# Altium schematic sheet Top Level.SchDoc
size A4
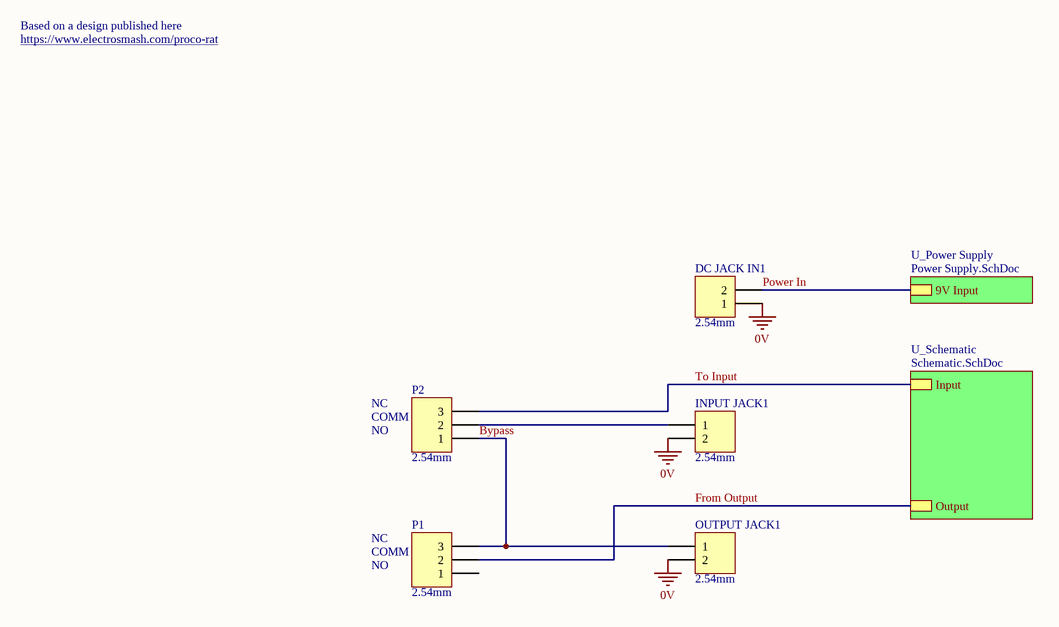
[diagram p0: Top Level.SchDoc]

## Parts
DC_JACK_IN1  2.54mm  [TH 2.54mm Header 1x2]
INPUT_JACK1  2.54mm  [TH 2.54mm Header 1x2]
OUTPUT_JACK1  2.54mm  [TH 2.54mm Header 1x2]
P1  2.54mm  [TH 2.54mm Header 1x3]
P2  2.54mm  [TH 2.54mm Header 1x3]

## Sub-sheets
U_Power Supply = Power Supply.SchDoc: 9V Input
U_Schematic = Schematic.SchDoc: Output, Input

## Nets
0V: DC_JACK_IN1.1 INPUT_JACK1.2 OUTPUT_JACK1.2
Bypass: OUTPUT_JACK1.1 P1.3 P2.1
From Output: P1.2 ; sheet U_Schematic/Output
Power In: DC_JACK_IN1.2 ; sheet U_Power Supply/9V Input
To Input: P2.3 ; sheet U_Schematic/Input
NetINPUT_JACK1_1: INPUT_JACK1.1 P2.2

Not connected (* = marked no-connect by the designer): P1 1

## Notes on the sheet
- https://www.electrosmash.com/proco-rat
- Based on a design published here
- NC
- COMM
- NO

## Library data of the parts
DC_JACK_IN1 INPUT_JACK1 OUTPUT_JACK1 = TH 2.54mm Header 1x2: Positions: 2; Angle: 0; Flange: No; Contact: NA; Part Number: TH 2.54mm Header 1x2; Pitch: 2.54mm; Row Spacing: 2.54mm
P1 P2 = TH 2.54mm Header 1x3: Positions: 3; Angle: 0; Flange: No; Contact: NA; Part Number: TH 2.54mm Header 1x3; Pitch: 2.54mm; Row Spacing: 2.54mm